# EAGLE schematic Schematic (EAGLE 7.2.0)
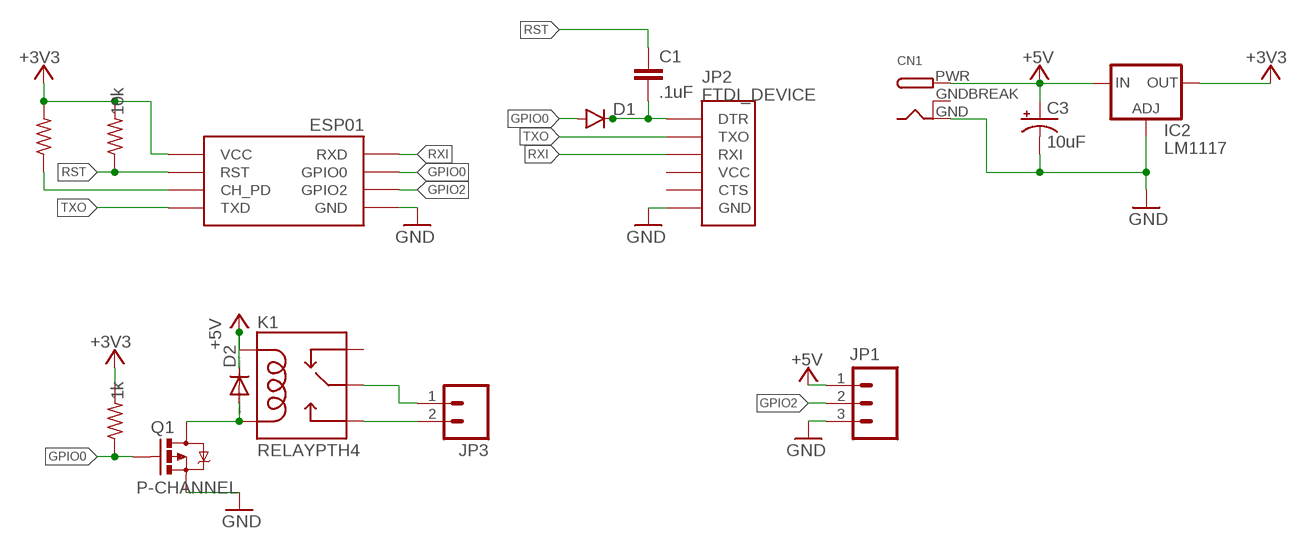
[diagram p0: schematic, sheet 1]

## Parts
C1  .1uF  CAPPTH1  [CAP-PTH-5MM]
C3  10uF  CPOL-USE2-5  [E2-5]
CN1  DCBARRELPTH  [DCJACK_2MM_PTH]
D1  DIODEPTH  [DIODE-1N4001]
D2  DIODE-DO41-7.6  [DO41-7.6]
ESP-02  ESP01  [ESP01]
IC2  LM1117  LD117AV  [TO220L1]
JP1  M03PTH  [1X03]
JP2  FTDI_DEVICE  [FTDI_DEVICE_SIDE]
JP3  M025MM  [SCREWTERMINAL-5MM-2]
K1  RELAYPTH4  [RELAY-JZC]
Q1  P-CHANNEL  MOSFET-PCHANNELFQP27P06  [TO220V]
R1  10k  R-US_0204/2V  [0204V]
R2  10k  R-US_0204/5  [0204/5]
R3  1k  R-US_0204/2V  [0204V]

## Nets
+3V3 [ext]: ESP-02.VCC IC2.2(OUT) R1.2 R2.2 R3.2
+5V: C3.+ CN1.PWR D2.C IC2.3(IN) JP1.1 K1.5(COIL1)
GND: C3.- CN1.GND ESP-02.GND IC2.1(ADJ) JP1.3 JP2.P$6(GND) Q1.3(S)
GPIO0: D1.A ESP-02.GPIO0 Q1.1(G) R3.1
GPIO2: ESP-02.GPIO2 JP1.2
N$1: C1.2 D1.C JP2.P$1(DTR)
N$2 [ext]: JP3.2 K1.3(NO)
N$3: ESP-02.CH_PD R2.1
N$6: D2.A K1.1(COIL2) Q1.2(D)
N$14 [ext]: JP3.1 K1.4(MAIN)
RST: C1.1 ESP-02.RST R1.1
RXI: ESP-02.RX(RXD) JP2.P$3(RXI)
TXO: ESP-02.TX(TXD) JP2.P$2(TXO)
Unconnected: JP2.P$4(VCC) JP2.P$5(CTS) K1.2(NC)

## Power pins joined to a net without a drawn wire
GNDBREAK: CN1.GNDBREAK

## Library data of the parts
C1 = SparkFun-Passives:CAP: Capacitor Standard 0603 ceramic capacitor, and 0.1" leaded capacitor.
C3 = rcl:CPOL-US: POLARIZED CAPACITOR, American symbol
CN1 = adafruit:DCBARREL: 2.0mm DC Barrel Jack DCJACK_2MM_PTH - Through Hole Jack (4UConnector: 05537)
D1 = SparkFun-DiscreteSemi:DIODE: Diode These are standard reverse protection diodes and small signal diodes. SMA package can handle up to about 1A. SOD-323 can handle about 200mA. What the SOD-323 package when ordering, there are some mfgs out there that are 5-pin packages.
D2 = diode:DIODE-: DIODE
ESP-02 = esp8266modules-pk:ESP01: ESP8266 Wifi module 01
IC2 = v-reg:LD117A?*: Low drop fixed and adjustable positive voltage regulators 1 A Source: http://www.st.com/stonline/products/literature/ds/7194/ld1117axx.pdf
JP1 = SparkFun-Connectors:M03: Header 3 Standard 3-pin 0.1" header. Use with straight break away headers (SKU : PRT-00116), right angle break away headers (PRT-00553), swiss pins (PRT-00743), machine pins (PRT-00117), and female headers (PRT-00115). Molex polarized connector foot print use with SKU : PRT-08232 with associated crimp pins and housings.
JP2 = SparkFun-Connectors:FTDI_DEVICE: Connector which mates to FTDI basic or FTDI cable.
JP3 = SparkFun-Connectors:M02: Standard 2-pin 0.1" header. Use with - straight break away headers ( PRT-00116) - right angle break away headers (PRT-00553) - swiss pins (PRT-00743) - machine pins (PRT-00117) - female headers (PRT-00115) Molex polarized connector foot print use with: PRT-08233 with associated crimp pins and housings. 2.54_SCREWTERM for use with PRT-10571. 3.5mm Screw Terminal footprints for PRT-08084 5mm Screw Terminal footprints for use with PRT-08432; STOREFRONT_ID: PRT-08432
K1 = SparkFun-Electromechanical:RELAY: SPDT relay (COM-00101)
Q1 = SparkFun-DiscreteSemi:MOSFET-PCHANNEL: Generic PMOSFET IRLML2244 - TRANS-11153 (SOT-23 -20V -4.3A) (1.Gate 2.Source 3.Drain) FQP27P06 - COM-10349 <http://www.sparkfun.com/products/10349> (TO-220 -60V -27A) (1.Gate 2.Source 3.Drain)
R1-R3 = resistor:R-US_: RESISTOR, American symbol

## Net classes
0 default: width 0.406 mm, clearance 0.203 mm
1 ext: width 0.762 mm